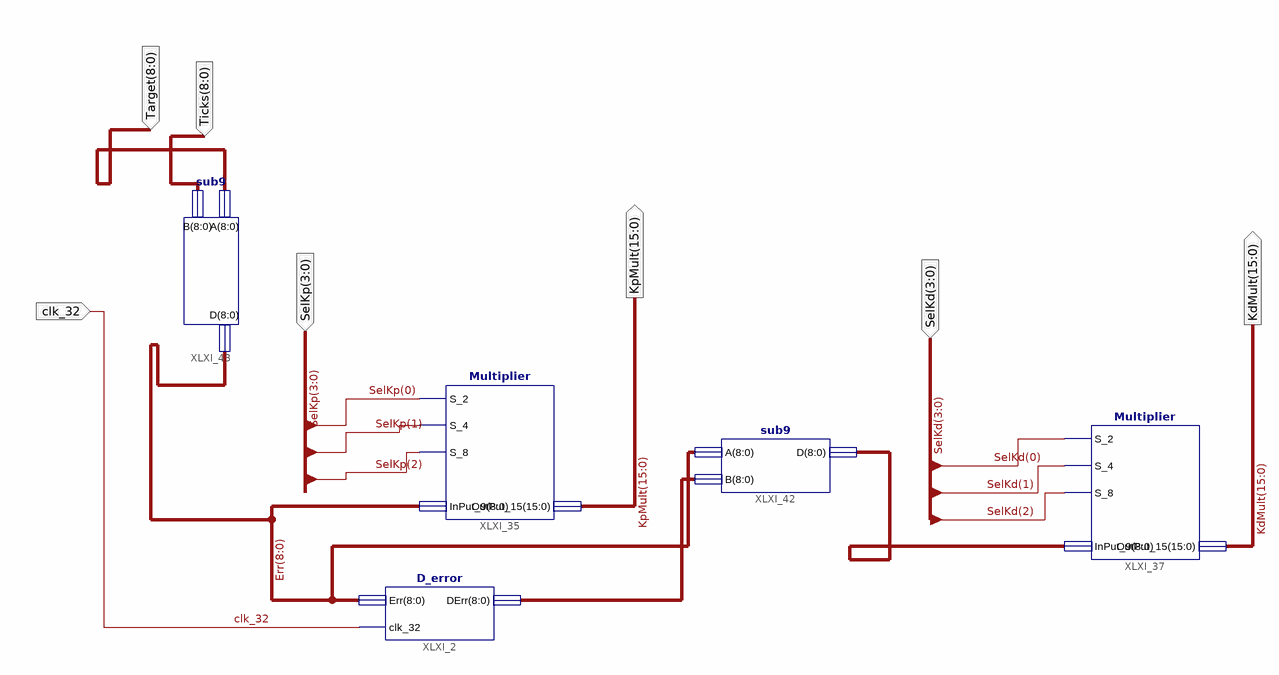
[diagram p0: schematic sheet 1]
// Xilinx ISE schematic TotError.sch (spartan3e) as structural Verilog: 5 symbols, 7 ports
module TotError (
  input  clk_32,
  input  [8:0] Ticks,
  input  [8:0] Target,
  input  [3:0] SelKd,
  input  [3:0] SelKp,
  output [15:0] KdMult,
  output [15:0] KpMult
);

  wire [8:0] Err, XLXN_17, XLXN_25;

  D_error XLXI_2 (.Err(Err), .clk_32(clk_32), .DErr(XLXN_17));
  Multiplier XLXI_37 (.S_2(SelKd[0]), .S_4(SelKd[1]), .S_8(SelKd[2]), .InPut_9(XLXN_25), .OutPut_15(KdMult));
  Multiplier XLXI_35 (.S_2(SelKp[0]), .S_4(SelKp[1]), .S_8(SelKp[2]), .InPut_9(Err), .OutPut_15(KpMult));
  sub9 XLXI_42 (.A(Err), .B(XLXN_17), .D(XLXN_25));
  sub9 XLXI_43 (.A(Target), .B(Ticks), .D(Err));
endmodule
